# EAGLE schematic LED_eyeSocket (EAGLE 7.3.0)
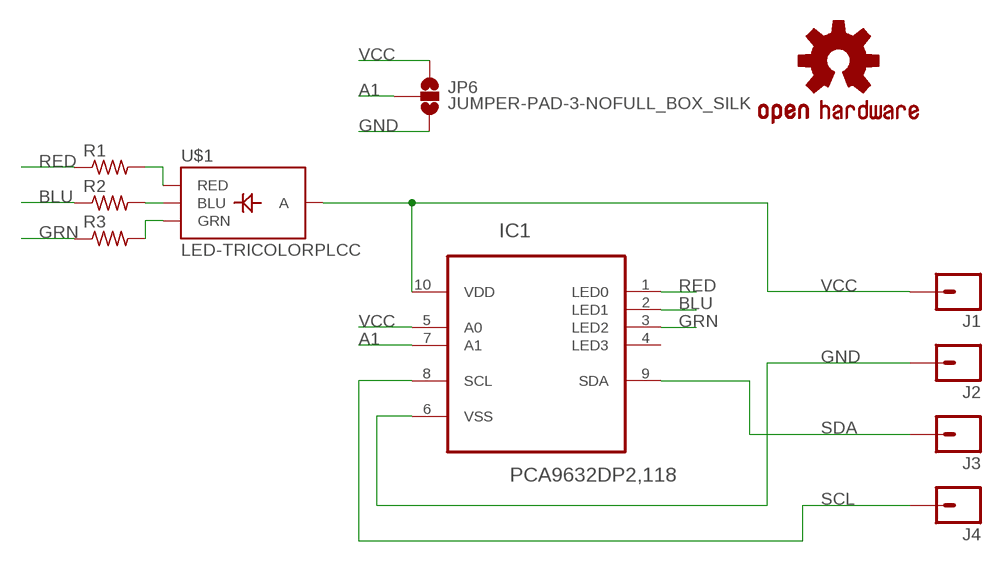
[diagram p0: schematic, sheet 1]

## Parts
IC1  PCA9632DP2,118  [SOP50P490X110-10N]
J1  M01NOSILK-KIT  [1X01NS-KIT]
J2  M01NOSILK-KIT  [1X01NS-KIT]
J3  M01NOSILK-KIT  [1X01NS-KIT]
J4  M01NOSILK-KIT  [1X01NS-KIT]
JP6  JUMPER-PAD-3-NOFULL_BOX_SILK  [PAD-JUMPER-3-NO_YES_SILK_FULL_BOX]
LOGO1  OSHW-LOGOS  [OSHW-LOGO-S]
R1  R-US_R0603  [R0603]
R2  R-US_R0603  [R0603]
R3  R-US_R0603  [R0603]
U$1  LED-TRICOLORPLCC  [LED-TRICOLOR-PLCC]

## Nets
A1: IC1.7(A1) JP6.2
BLU: IC1.2(LED1) R2.1
GND: IC1.6(VSS) J2.1 JP6.3
GRN: IC1.3(LED2) R3.1
N$1: R1.2 U$1.PAD4(RED)
N$2: R2.2 U$1.PAD2(BLU)
N$3: R3.2 U$1.PAD3(GRN)
RED: IC1.1(LED0) R1.1
SCL: IC1.8(SCL) J4.1
SDA: IC1.9(SDA) J3.1
VCC: IC1.5(A0) IC1.10(VDD) J1.1 JP6.1 U$1.PAD1(A)
Unconnected: IC1.4(LED3)

## Library data of the parts
IC1 = NXP_By_element14_Batch_1:PCA9632DP2,118: 4-bit Fm+ I2C-bus low power LED driver; MPN: PCA9632DP2,118; OC_FARNELL: 1867849; OC_NEWARK: 70R6723; PACKAGE: TSSOP-10; SUPPLIER: NXP
J1-J4 = SparkFun-Connectors:M01: Header 1 Standard 1-pin 0.1" header. Use with straight break away headers (SKU : PRT-00116), right angle break away headers (PRT-00553), swiss pins (PRT-00743), machine pins (PRT-00117), and female headers (PRT-00115). SMTSO-256-ET is a "flush mount" nut for a 4-40 screw. The older package used to be too tight, and did not allow it to sit properly thru the drill hit. The latest (0.165DIA) fits nice and snug.
JP6 = SparkFun-Passives:JUMPER-PAD-3-NO
LOGO1 = SparkFun-Aesthetics:OSHW-LOGO: Open Source Hardware Logo This logo indicates the piece of hardware it is found on incorporates a OSHW license and/or adheres to the definition of open source hardware found here: http://freedomdefined.org/OSHW
R1-R3 = adafruit:R-US_: RESISTOR, American symbol
U$1 = SparkFun-LED:LED-TRICOLOR: Tri-Color LED SMD Proven layout and schematic for triple color LED in SMD package - common anode. Spark Fun Electronics SKU : COM-07844